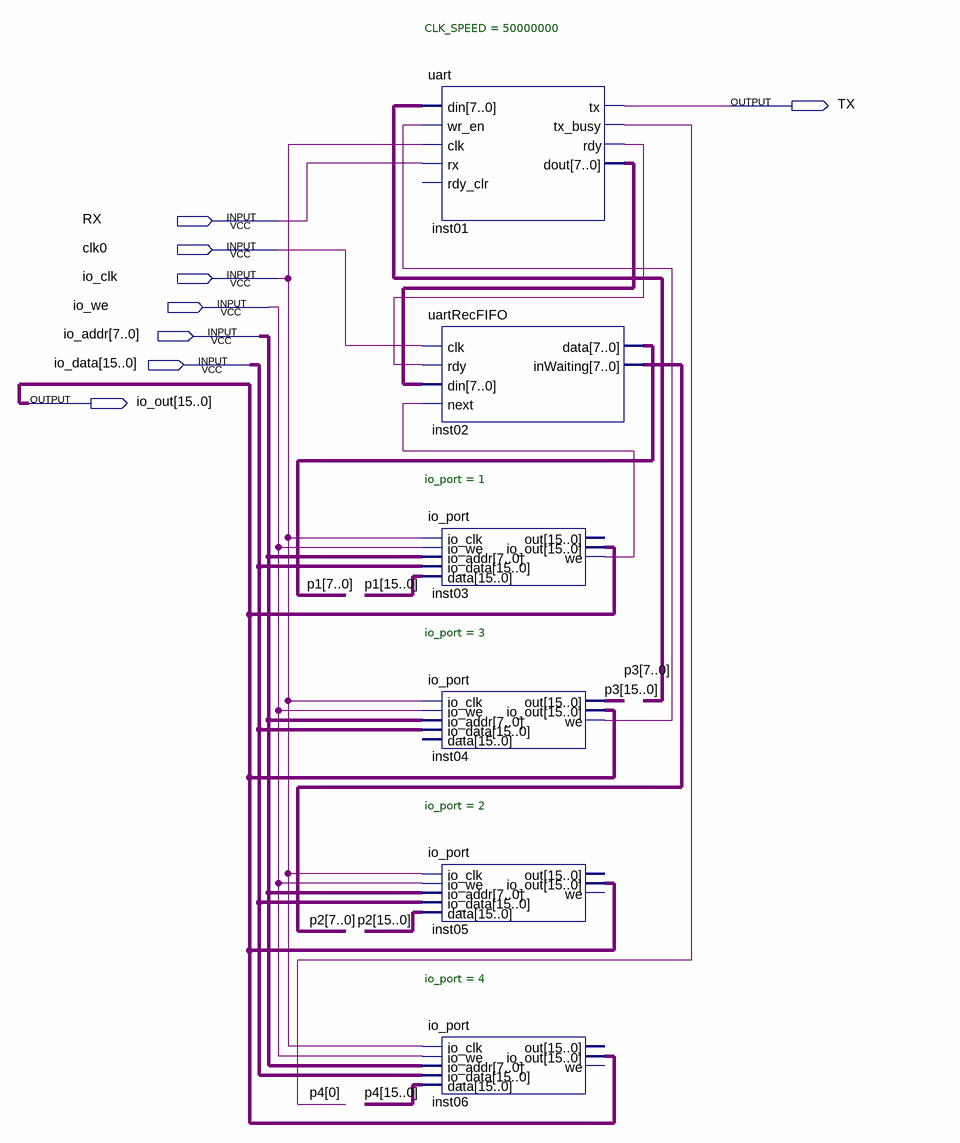
[diagram p0: schematic sheet]
// Quartus schematic uart_io.bdf as structural Verilog: 6 symbols, 8 pins
module uart_io (
  input  RX,
  input  clk0,
  input  io_clk,
  input  io_we,
  input  [7:0] io_addr,
  input  [15:0] io_data,
  output TX,
  output [15:0] io_out
);

  wire inst01_rdy, inst03_we, inst04_we;
  wire [7:0] inst01_dout;
  wire [15:0] p1, p2, p3, p4;

  uart #(.CLK_SPEED(50000000)) inst01 (
    .din(p3[7:0]), .wr_en(inst04_we), .clk(io_clk), .rx(RX), .tx(TX), .tx_busy(p4[0]), .rdy(inst01_rdy),
    .dout(inst01_dout));  // open: rdy_clr
  uartRecFIFO inst02 (
    .clk(clk0), .rdy(inst01_rdy), .din(inst01_dout), .next(inst03_we), .data(p1[7:0]), .inWaiting(p2[7:0]));
  io_port #(.io_port(1)) inst03 (
    .io_clk(io_clk), .io_we(io_we), .io_addr(io_addr), .io_data(io_data), .data(p1), .io_out(io_out),
    .we(inst03_we));  // open: out
  io_port #(.io_port(3)) inst04 (
    .io_clk(io_clk), .io_we(io_we), .io_addr(io_addr), .io_data(io_data), .out(p3), .io_out(io_out),
    .we(inst04_we));  // open: data
  io_port #(.io_port(2)) inst05 (
    .io_clk(io_clk), .io_we(io_we), .io_addr(io_addr), .io_data(io_data), .data(p2), .io_out(io_out));  // open: out, we
  io_port #(.io_port(4)) inst06 (
    .io_clk(io_clk), .io_we(io_we), .io_addr(io_addr), .io_data(io_data), .data(p4), .io_out(io_out));  // open: out, we
endmodule
